# EAGLE design SmodJSTK (EAGLE 6.3)
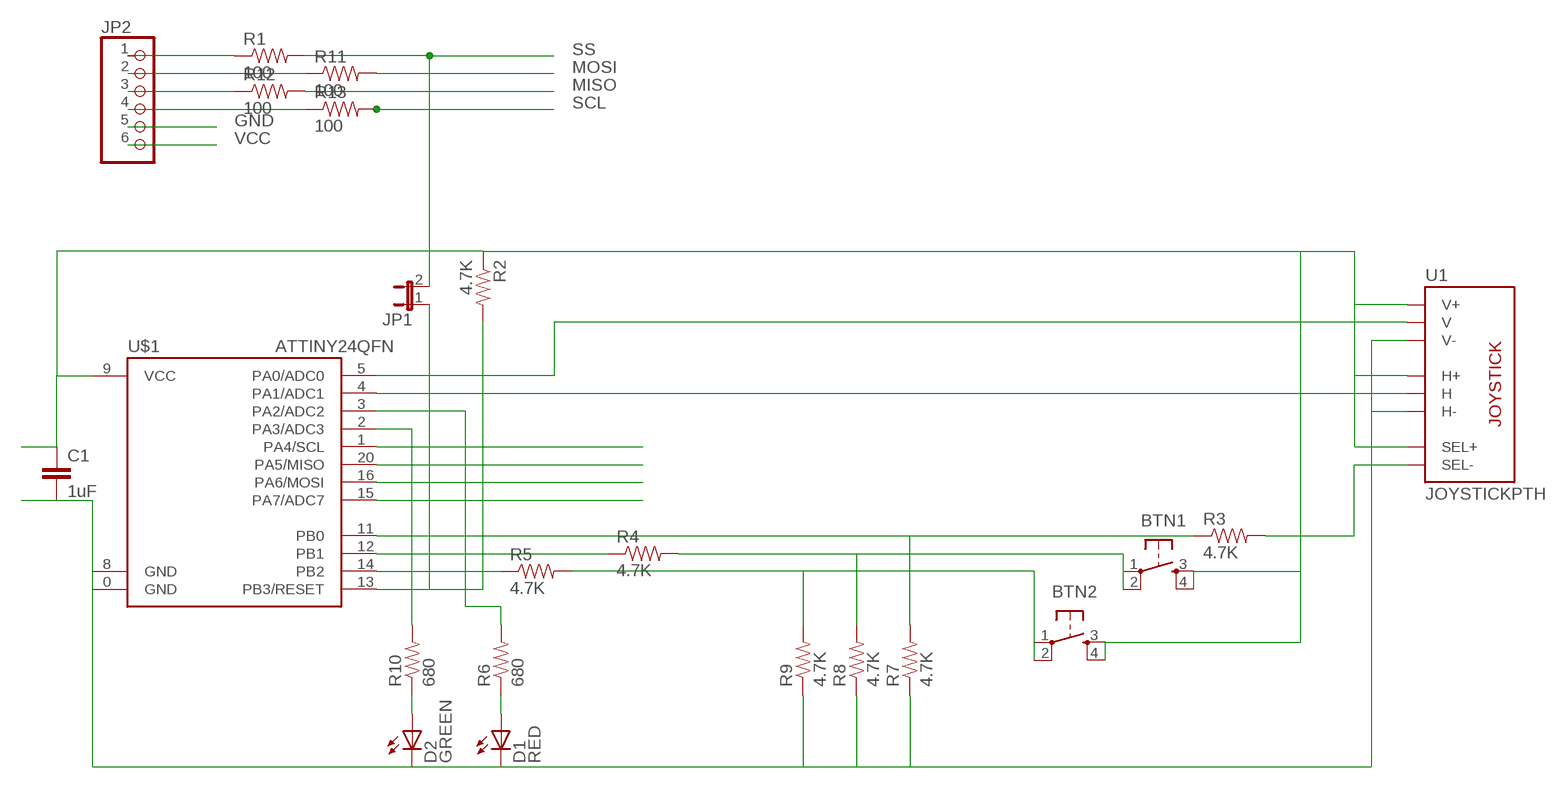
[diagram p0: schematic, sheet 1]

## Parts
BTN1  TAC_SWITCHPTH  [TACTILE-PTH]
BTN2  TAC_SWITCHPTH  [TACTILE-PTH]
C1  1uF  CAP0603-CAP  [0603-CAP]
D1  RED  LED-RED0603  [LED-0603]
D2  GREEN  LED-GREEN0603  [LED-0603]
JP1  JUMPER-2PTH  [1X02]
JP2  PINHD-1X6  [1X06]
R1  100  RESISTOR0603-RES  [0603-RES]
R2  4.7K  RESISTOR0603-RES  [0603-RES]
R3  4.7K  RESISTOR0603-RES  [0603-RES]
R4  4.7K  RESISTOR0603-RES  [0603-RES]
R5  4.7K  RESISTOR0603-RES  [0603-RES]
R6  680  RESISTOR0603-RES  [0603-RES]
R7  4.7K  RESISTOR0603-RES  [0603-RES]
R8  4.7K  RESISTOR0603-RES  [0603-RES]
R9  4.7K  RESISTOR0603-RES  [0603-RES]
R10  680  RESISTOR0603-RES  [0603-RES]
R11  100  RESISTOR0603-RES  [0603-RES]
R12  100  RESISTOR0603-RES  [0603-RES]
R13  100  RESISTOR0603-RES  [0603-RES]
U1  JOYSTICKPTH  [JOYSTICK]
U$1  ATTINY24QFN  [QFN20]

## Nets
GND: C1.2 D1.C D2.C JP2.5 R7.1 R8.1 R9.1 U1.H3(H-) U1.V3(V-) U$1.0(GND) U$1.8(GND)
MISO: R12.2 U$1.20(PA5/MISO)
MOSI: R11.2 U$1.16(PA6/MOSI)
N$1: BTN1.1 BTN1.2 R4.2 R8.2
N$2: BTN2.1 BTN2.2 R5.2 R9.2
N$3: JP1.1 R2.2 U$1.13(PB3/RESET)
N$4: R3.1 R7.2 U$1.11(PB0)
N$5: R3.2 U1.B2A(SEL-)
N$7: R5.1 U$1.14(PB2)
N$8: JP2.1 R1.1
N$9: R4.1 U$1.12(PB1)
N$11: D2.A R10.1
N$12: D1.A R6.1
N$13: R6.2 U$1.3(PA2/ADC2)
N$14: R10.2 U$1.2(PA3/ADC3)
N$15: U1.V2(V) U$1.5(PA0/ADC0)
N$16: U1.H2(H) U$1.4(PA1/ADC1)
N$17: JP2.2 R11.1
N$18: JP2.3 R12.1
N$19: JP2.4 R13.1
SCL: R13.2 U$1.1(PA4/SCL)
SS: JP1.2 R1.2 U$1.15(PA7/ADC7)
VCC: BTN1.3 BTN1.4 BTN2.3 BTN2.4 C1.1 JP2.6 R2.1 U1.B1A(SEL+) U1.H1(H+) U1.V1(V+) U$1.9(VCC)

## Library data of the parts
BTN1 BTN2 = 1x05smd:TAC_SWITCH: Momentary Switch Button commonly used for reset or general input. Spark Fun Electronics SKU : COM-00097
C1 = 1x05smd:CAP: Capacitor Standard 0603 ceramic capacitor, and 0.1" leaded capacitor.
D1 = SparkFun-LED:LED-RED: Assorted Red LEDs LilyPad 1206- DIO-09912 1206- DIO-00809 0603- DIO-00819; PROD_ID: DIO-00819
D2 = SparkFun-LED:LED-GREEN: Various green LEDs 0603- DIO-00821 LARGE- DIO-00862 LILYPAD- DIO-09910; PROD_ID: DIO-00821
JP1 = 1x05smd:JUMPER-2: Jumper Basic 0.1" spaced jumper. Use with breakaway headers.
JP2 = adafruit:PINHD-1X6: PIN HEADER
R1-R13 = 1x05smd:RESISTOR: Resistor Basic schematic elements and footprints for 0603, 1206, and PTH 1/10th watt (small) resistors.
U1 = SparkFun:JOYSTICK: Thumb Joystick Joystick commonly found in PS2 controllers. Two pots and a select switch. Footprint proven. Spark Fun Electronics SKU : COM-09032
U$1 = SparkFun-DigitalIC:ATTINY24: Atmel 20-pin 2kB flash uC

## Board
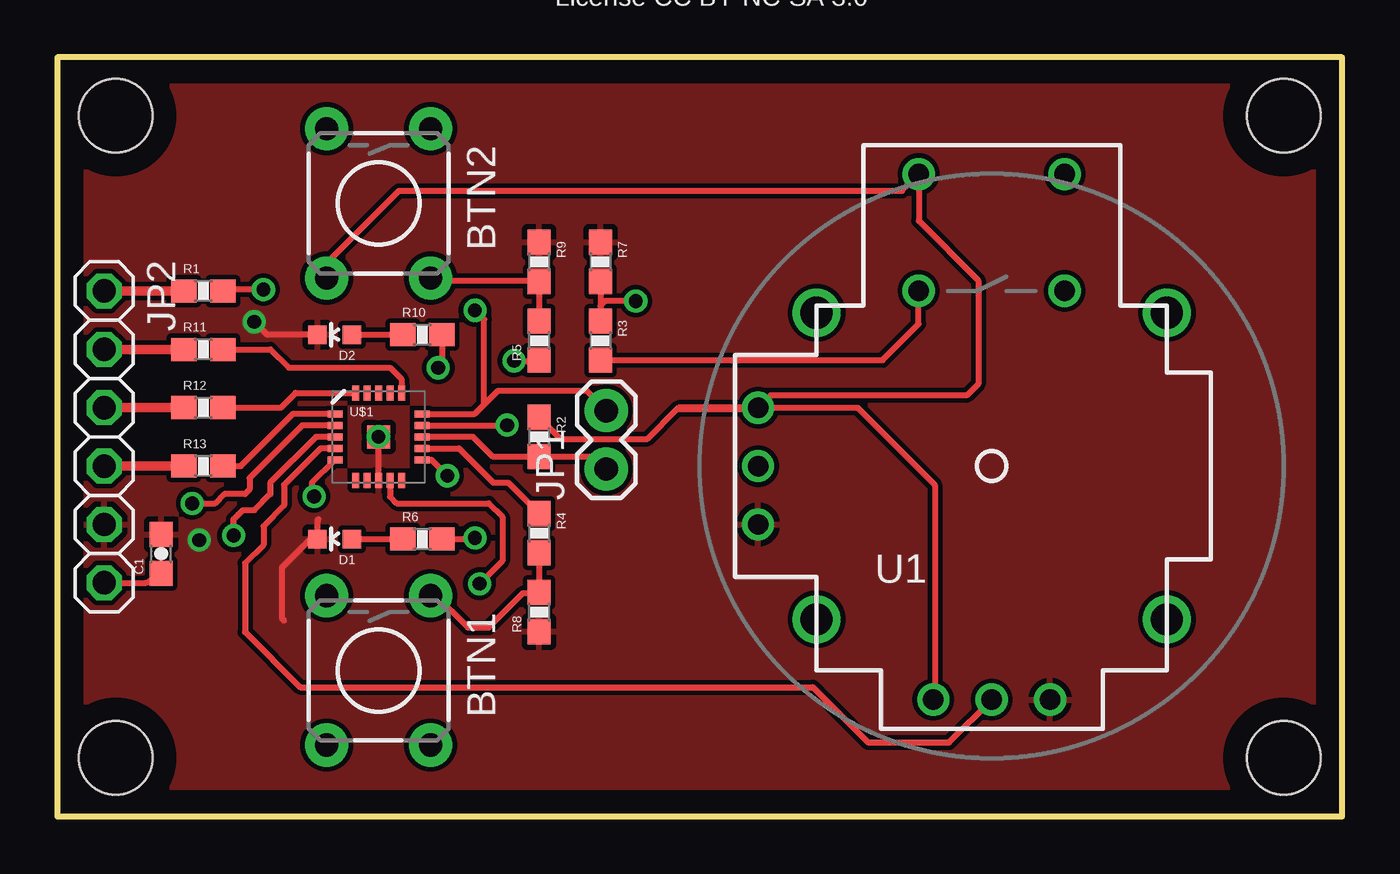
[diagram p1: board, top side]
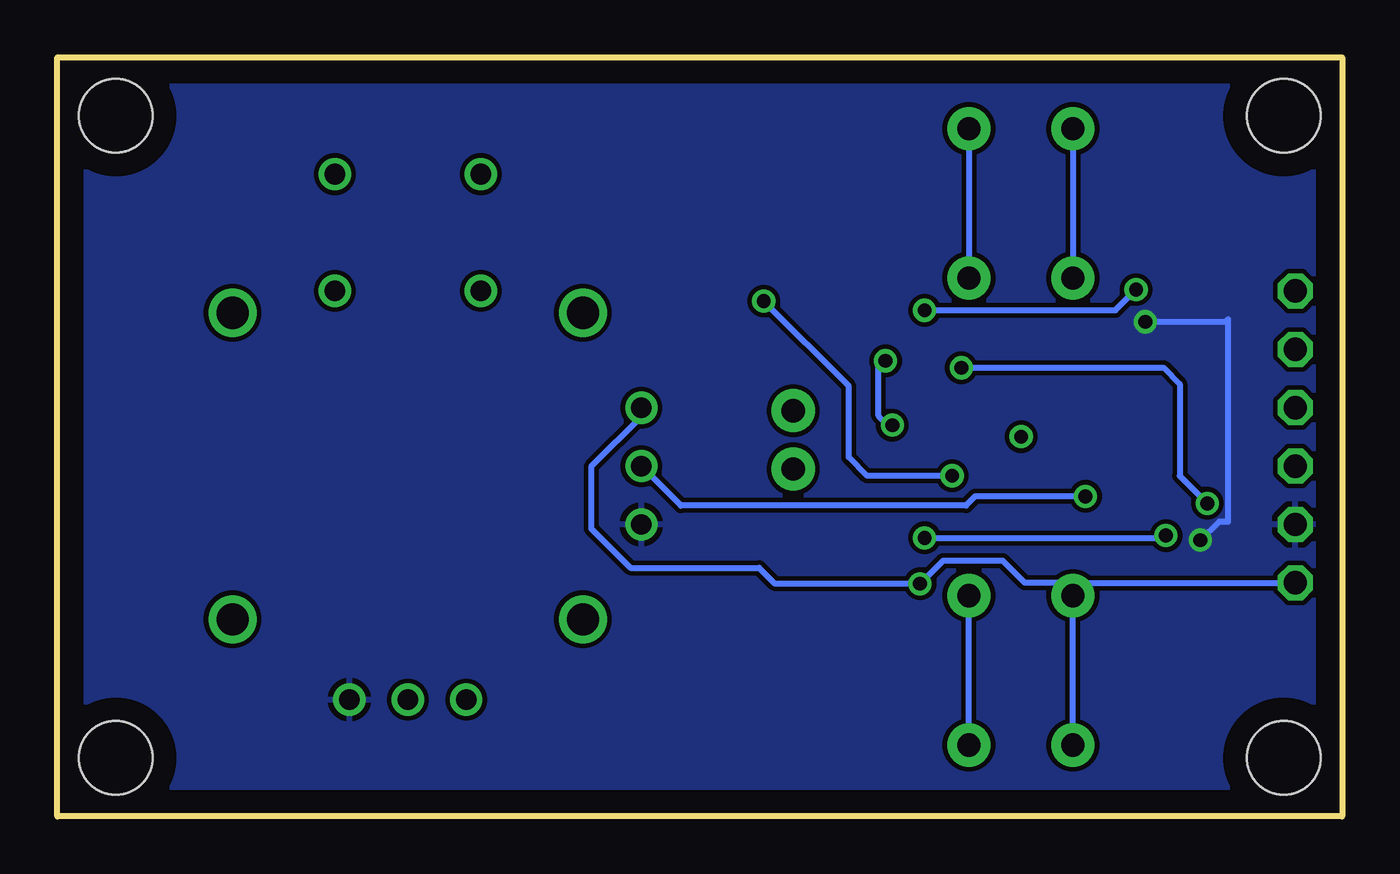
[diagram p2: board, bottom side, seen from below]

Size 55.88 x 33.02 mm. Coordinates in mm from the lower left corner, seen from the top.
Outline: 0,0 55.88,0 55.88,33.02 0,33.02 0,0
Copper layers (1*16): Top 0.035mm / dielectric 1.5mm / Bottom 0.035mm
Design rules "default": minimum track width 10mil, minimum drill 24mil, track to track 8mil, track to pad 8mil, pad to pad 8mil, via to via 8mil, smd to smd 8mil, copper to edge 40mil, drill to drill 8mil, minimum pad ring 10mil, minimum via ring 8mil, stop-mask expansion 4mil, vias tented up to drill 0mil, thermal gap 10mil
Holes 3.2 mm at 2.54,2.54 2.54,30.48 53.34,30.48 53.34,2.54

### Footprints (pad centres in the part's own frame; a part is rotated, then mirrored left to right if it is on the bottom)
TACTILE-PTH = drill 1.016 pad 1.88: 1 -3.251,2.261; 2 3.251,2.261; 3 -3.251,-2.261; 4 3.251,-2.261
0603-CAP = smd 1.1 x 1: 1 -0.85,0; 2 0.85,0
LED-0603 = smd 0.8 x 0.8: A 0,-0.75; C 0,0.75
1X02 = drill 1.016 pad 1.88: 1 0,0; 2 2.54,0
1X06 = drill 1.016 octagon: 1 -6.35,0; 2 -3.81,0; 3 -1.27,0; 4 1.27,0; 5 3.81,0; 6 6.35,0
0603-RES = smd 1.1 x 1: 1 -0.85,0; 2 0.85,0
JOYSTICK = drill 0.9: B1A -3.175,12.7; B1B 3.175,12.7; B2A -3.175,7.62; B2B 3.175,7.62 | drill 0.889: H1 -2.54,-10.16; H2 0,-10.16; H3 2.54,-10.16; V1 -10.16,2.54; V2 -10.16,0; V3 -10.16,-2.54 | drill 1.397: MOUNT1 -7.62,6.668; MOUNT2 -7.62,-6.668; MOUNT3 7.62,-6.668; MOUNT4 7.62,6.668
QFN20 = smd 1 x 1: 0 0,0 | smd 0.65 x 0.3: 1 -1.9,1; 2 -1.9,0.5; 3 -1.9,0; 4 -1.9,-0.5; 5 -1.9,-1; 11 1.9,-1; 12 1.9,-0.5; 13 1.9,0; 14 1.9,0.5; 15 1.9,1 | smd 0.3 x 0.65: 6 -1,-1.9; 7 -0.5,-1.9; 8 0,-1.9; 9 0.5,-1.9; 10 1,-1.9; 16 1,1.9; 17 0.5,1.9; 18 0,1.9; 19 -0.5,1.9; 20 -1,1.9

### Placement (x,y rotation side)
BTN1  13.97,6.35 270 top
BTN2  13.97,26.67 270 top
C1  4.51,11.42 90 top
D1  12.07,12.06 90 top
D2  12.07,20.95 90 top
JP1  23.88,15.11 90 top
JP2  2.03,16.51 270 top
R1  6.35,22.86 0 top
R2  20.96,16.51 270 top
R3  23.62,20.7 270 top
R4  20.96,12.32 270 top
R5  20.96,20.7 90 top
R6  15.88,12.06 0 top
R7  23.62,24.13 270 top
R8  20.96,8.89 90 top
R9  20.96,24.13 270 top
R10  15.88,20.95 0 top
R11  6.35,20.32 0 top
R12  6.35,17.78 0 top
R13  6.35,15.24 0 top
U1  40.64,15.24 0 top
U$1  13.97,16.51 0 top

### Tracks (layer width: path | path; a pad name or v marks a point on that pad's centre or on a via)
GND  (via drill 0.6)
  Top 0.254: U$1.8 U$1.0 | D2.C 9.12,20.95 v8.56,21.52 | v6.16,12.02 6.16,11.92 | 9.86,8.52 9.76,8.62 9.76,10.82 11,12.06 D1.C 11.32,12.87 11.36,12.92
  Bottom 0.254: v8.56,21.52 5.06,21.52 4.96,21.62 4.96,12.82 5.36,12.82 v6.16,12.02
  pour Top: 0,0 55.88,0 55.88,33.02 0,33.02
  pour Bottom: 0,0 55.88,0 55.88,33.02 0,33.02
MISO
  Top 0.254: R12.2 9.72,17.78 10.36,18.42 U$1.20
MOSI
  Top 0.254: R11.2 9.26,20.32 10.06,19.52 14.46,19.52 14.96,19.02 U$1.16
N$1
  Top 0.254: R4.2 R8.2 20.94,9.72 20.26,9.72 18.76,8.22 17.86,8.22 16.37,9.71 16.37,9.74 BTN1.1
  Bottom 0.254: BTN1.2 BTN1.1
N$2
  Top 0.254: R5.2 R9.2 16.37,23.28 BTN2.2
  Bottom 0.254: BTN2.1 BTN2.2
N$3
  Top 0.254: U$1.13 18.06,16.52 18.92,15.66 R2.2 23.33,15.66 JP1.1
N$4  (via drill 0.6)
  Top 0.254: R7.2 23.62,22.22 | 23.62,22.22 R3.1 | U$1.11 16.27,15.51 v16.96,14.82 | v25.16,22.42 23.82,22.42 23.62,22.22
  Bottom 0.254: v16.96,14.82 20.66,14.82 21.46,15.62 21.46,18.72 v25.16,22.42
N$5
  Top 0.254: R3.2 35.89,19.85 37.46,21.42 U1.B2A
N$6  (via drill 0.6)
  other vias: 13.96,16.52
N$7  (via drill 0.6)
  Top 0.254: U$1.14 19.25,17.01 19.26,17.02 v19.56,17.02 | v19.86,19.82 20.92,19.82 R5.1
  Bottom 0.254: v19.56,17.02 19.76,17.02 20.16,17.42 20.16,19.52 v19.86,19.82
N$8
  Top 0.406: JP2.1 R1.1
N$9
  Top 0.254: U$1.12 17.47,16.01 18.96,14.52 19.6,14.52 R4.1
N$11
  Top 0.254: D2.A R10.1
N$12
  Top 0.254: D1.A R6.1
N$13  (via drill 0.6)
  Top 0.254: U$1.3 11.25,16.51 9.26,14.52 9.26,14.02 8.56,13.32 8.06,13.32 7.86,13.12 7.66,12.92 v7.66,12.22 | R6.2 18.11,12.06 v18.16,12.12
  Bottom 0.254: v18.16,12.12 7.76,12.12 v7.66,12.22
N$14  (via drill 0.6)
  Top 0.254: U$1.2 10.65,17.01 8.36,14.72 8.36,14.22 8.16,14.02 7.26,14.02 6.86,13.62 v5.86,13.62 | R10.2 16.73,19.69 v16.56,19.52
  Bottom 0.254: v16.56,19.52 7.76,19.52 7.06,18.82 7.06,14.82 v5.86,13.62
N$15  (via drill 0.6)
  Top 0.254: U$1.5 12.05,15.51 11.06,14.52 11.06,14.02 v11.16,13.92
  Bottom 0.254: v11.16,13.92 15.96,13.92 16.36,13.52 28.76,13.52 U1.V2
N$16
  Top 0.254: U$1.4 11.45,16.01 9.86,14.42 9.86,13.52 8.96,12.62 8.96,11.82 8.16,11.02 8.16,8.02 10.56,5.62 32.86,5.62 35.26,3.22 38.78,3.22 U1.H2
N$17
  Top 0.406: JP2.2 R11.1
N$18
  Top 0.406: JP2.3 R12.1
N$19
  Top 0.406: JP2.4 R13.1
SCL
  Top 0.254: R13.2 7.98,15.24 10.26,17.52 U$1.1
SS  (via drill 0.6)
  Top 0.254: 18.56,17.92 19.16,18.52 23.01,18.52 JP1.2 | U$1.15 18.15,17.51 18.56,17.92 | 18.56,17.92 18.56,21.62 v18.16,22.02 | v8.96,22.92 7.26,22.92 R1.2
  Bottom 0.254: v18.16,22.02 9.86,22.02 v8.96,22.92
VCC  (via drill 0.6)
  Top 0.254: U1.V1 31.02,18.32 39.56,18.32 40.06,18.82 40.06,23.32 37.47,25.91 U1.B1A 36.74,27.22 14.86,27.22 11.71,24.07 BTN2.4 | U1.V1 34.8,17.78 38.16,14.42 38.16,5.14 U1.H1 | U1.V1 27.02,17.78 26.96,17.72 | R2.1 21.89,16.42 25.66,16.42 26.96,17.72 | U$1.9 14.47,13.91 14.76,13.62 18.76,13.62 19.36,13.02 19.36,11.12 v18.36,10.12 | 26.96,17.72 30.36,17.72 v30.46,17.82 | JP2.6 3.85,10.16 C1.1
  Bottom 0.254: BTN2.3 BTN2.4 | BTN1.4 BTN1.3 11.15,10.16 | 11.15,10.16 JP2.6 | v30.46,17.82 30.46,17.42 32.66,15.22 32.66,12.52 30.96,10.82 25.36,10.82 24.66,10.12 v18.36,10.12 17.36,11.12 14.76,11.12 13.8,10.16 11.15,10.16

### Text on the board
_tsilk: Made by Shannon Strutz / For the University of Wisconsin - Stout / 2013 / / License CC BY-NC-SA 3.0